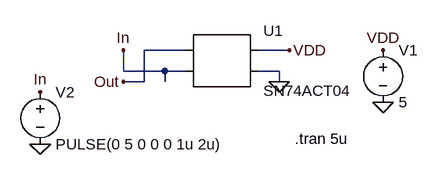
[diagram p0: schematic Test_Inverter.asc]
Test_Inverter.asc, the LTspice schematic file:
Version 4
SHEET 1 880 680
WIRE 128 160 64 160
WIRE 288 160 240 160
WIRE 32 192 32 160
WIRE 96 192 32 192
WIRE 128 192 96 192
WIRE 272 192 240 192
WIRE 64 208 64 160
WIRE 64 208 32 208
WIRE 96 208 96 192
WIRE 272 208 272 192
FLAG -96 304 0
FLAG 432 240 0
FLAG 272 208 0
FLAG -96 224 In
FLAG 32 160 In
FLAG 32 208 Out
FLAG 432 160 VDD
FLAG 288 160 VDD
SYMBOL AutoGenerated\\SN74ACT04 176 176 R0
SYMATTR InstName U1
SYMBOL voltage 432 144 R0
WINDOW 123 0 0 Left 0
WINDOW 39 0 0 Left 0
SYMATTR InstName V1
SYMATTR Value 5
SYMBOL voltage -96 208 R0
WINDOW 123 0 0 Left 0
WINDOW 39 0 0 Left 0
SYMATTR InstName V2
SYMATTR Value PULSE(0 5 0 0 0 1u 2u)
TEXT 296 296 Left 2 !.tran 5u

The netlist it stands for:
* Test_Inverter.asc
* U1: SN74ACT04 (symbol AutoGenerated\SN74ACT04 not available, pins judged from their places): pin1=Out pin2=In pin3=VDD pin4=0
V1 VDD 0 5
V2 In 0 PULSE(0 5 0 0 0 1u 2u)
.tran 5u
.backanno
.end